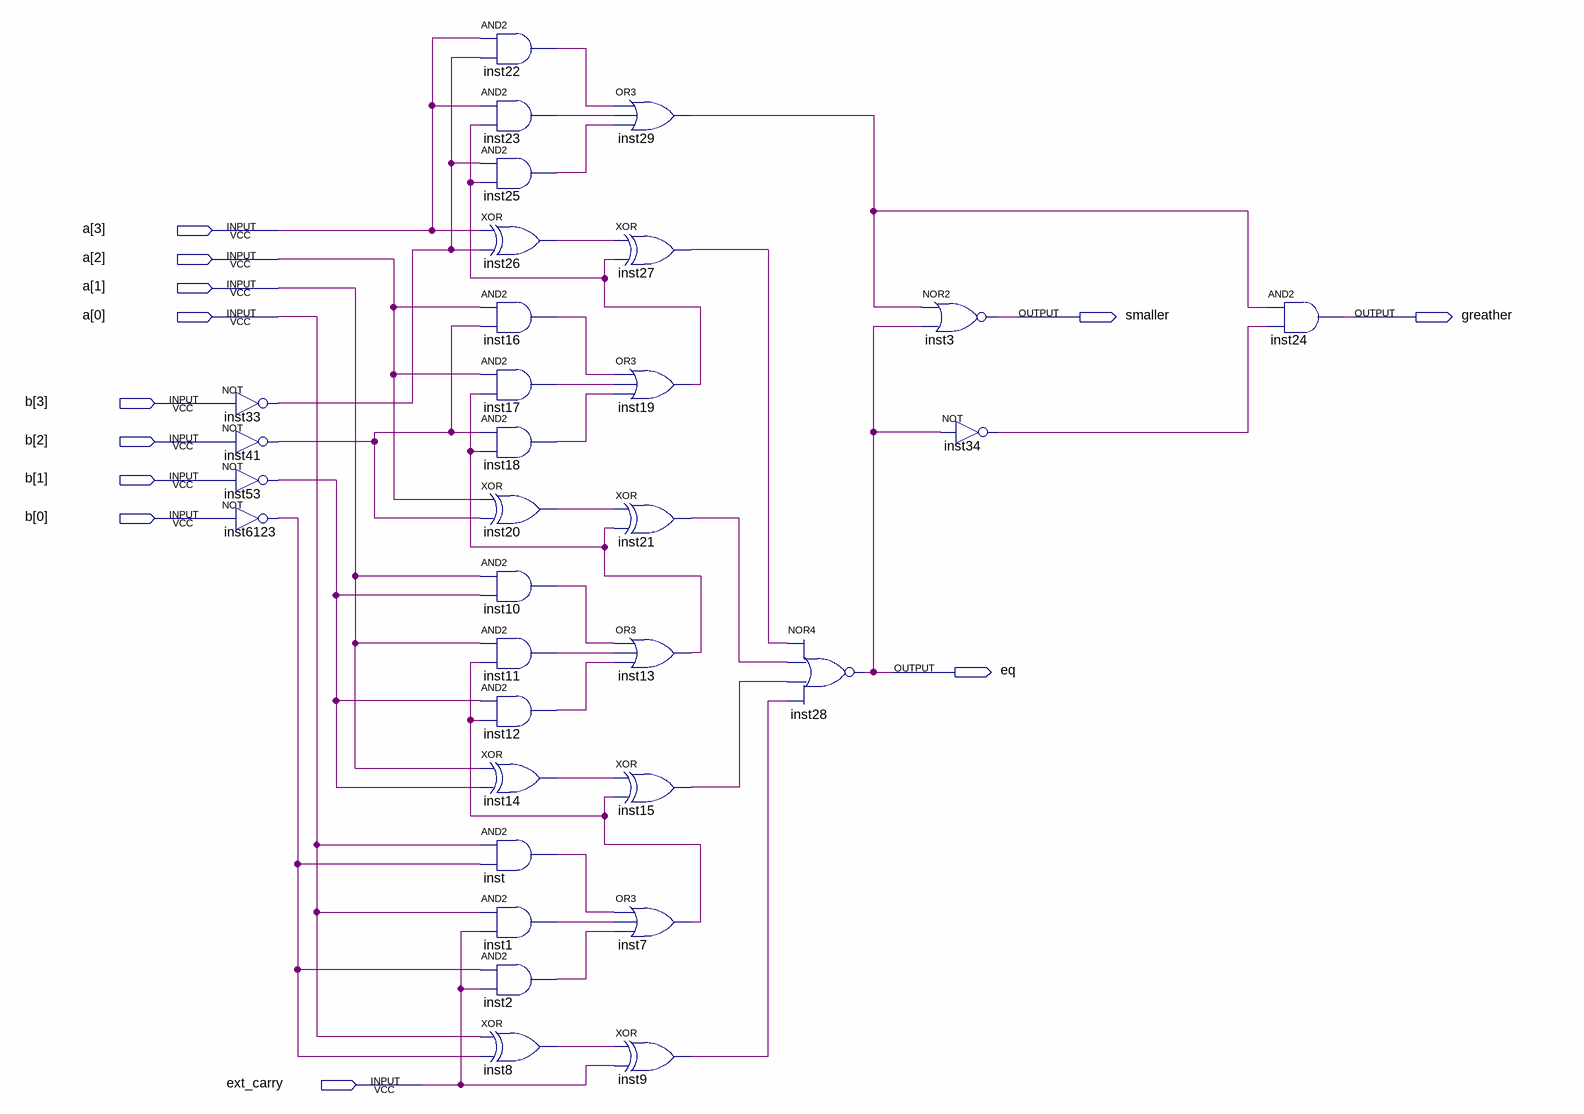
[diagram p0: schematic sheet]
// Quartus schematic top.bdf as structural Verilog: 32 symbols, 12 pins
module top (
  input  [3:0] a,
  input  [3:0] b,
  input  ext_carry,
  output smaller,
  output greather,
  output eq
);

  wire inst1_out, inst2_out, inst7_out, inst8_out, inst9_out, inst10_out, inst11_out, inst12_out, inst13_out,
       inst14_out, inst15_out, inst16_out, inst17_out, inst18_out, inst19_out, inst20_out, inst21_out,
       inst22_out, inst23_out, inst25_out, inst26_out, inst27_out, inst29_out, inst33_out, inst34_out,
       inst41_out, inst53_out, inst6123_out, inst_out;

  not inst33 (inst33_out, b[3]);
  not inst41 (inst41_out, b[2]);
  not inst53 (inst53_out, b[1]);
  not inst6123 (inst6123_out, b[0]);
  and inst22 (inst22_out, a[3], inst33_out);
  and inst23 (inst23_out, a[3], inst19_out);
  and inst25 (inst25_out, inst33_out, inst19_out);
  xor inst26 (inst26_out, a[3], inst33_out);
  and inst16 (inst16_out, a[2], inst41_out);
  and inst17 (inst17_out, a[2], inst13_out);
  and inst18 (inst18_out, inst41_out, inst13_out);
  xor inst20 (inst20_out, a[2], inst41_out);
  and inst10 (inst10_out, a[1], inst53_out);
  and inst11 (inst11_out, a[1], inst7_out);
  and inst12 (inst12_out, inst53_out, inst7_out);
  xor inst14 (inst14_out, a[1], inst53_out);
  and inst (inst_out, a[0], inst6123_out);
  and inst1 (inst1_out, a[0], ext_carry);
  and inst2 (inst2_out, inst6123_out, ext_carry);
  xor inst8 (inst8_out, a[0], inst6123_out);
  or inst29 (inst29_out, inst22_out, inst23_out, inst25_out);
  xor inst27 (inst27_out, inst26_out, inst19_out);
  or inst19 (inst19_out, inst16_out, inst17_out, inst18_out);
  xor inst21 (inst21_out, inst20_out, inst13_out);
  or inst13 (inst13_out, inst10_out, inst11_out, inst12_out);
  xor inst15 (inst15_out, inst14_out, inst7_out);
  or inst7 (inst7_out, inst_out, inst1_out, inst2_out);
  xor inst9 (inst9_out, inst8_out, ext_carry);
  nor inst28 (eq, inst27_out, inst21_out, inst15_out, inst9_out);
  nor inst3 (smaller, inst29_out, eq);
  not inst34 (inst34_out, eq);
  and inst24 (greather, inst29_out, inst34_out);
endmodule
